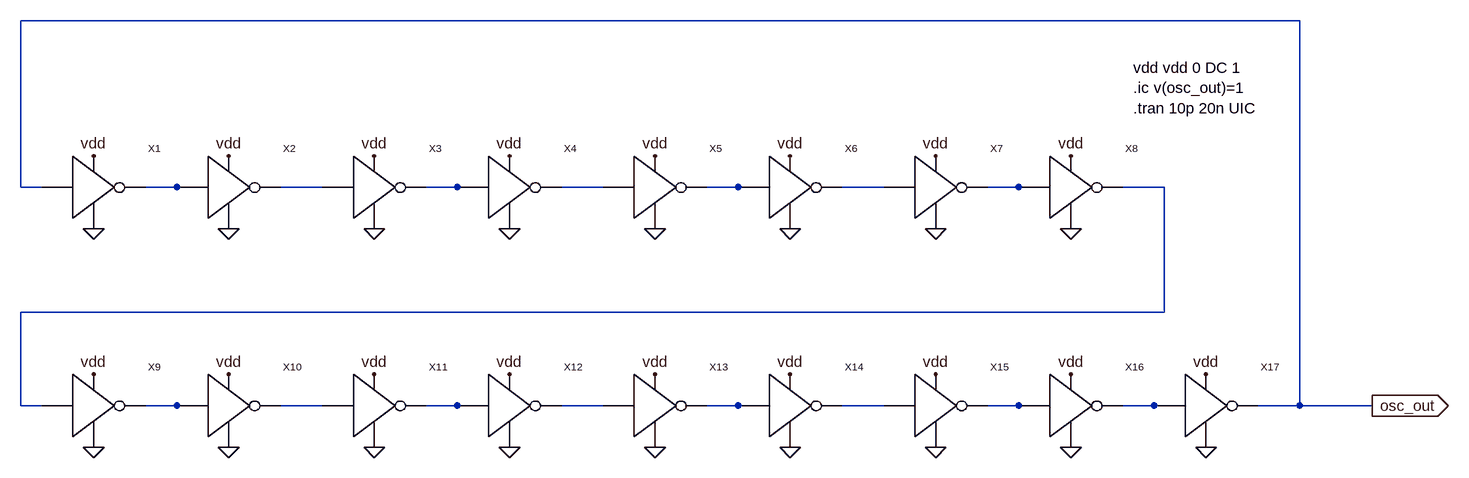
[diagram p0: schematic ringoscillator.asc]
ringoscillator.asc, the LTspice schematic file:
Version 4
SHEET 1 2264 680
WIRE 2000 -80 32 -80
WIRE 32 176 32 -80
WIRE 64 176 32 176
WIRE 272 176 224 176
WIRE 288 176 272 176
WIRE 496 176 432 176
WIRE 704 176 656 176
WIRE 720 176 704 176
WIRE 928 176 864 176
WIRE 1136 176 1088 176
WIRE 1152 176 1136 176
WIRE 1360 176 1296 176
WIRE 1568 176 1520 176
WIRE 1584 176 1568 176
WIRE 1792 176 1728 176
WIRE 1792 368 1792 176
WIRE 1792 368 32 368
WIRE 32 512 32 368
WIRE 64 512 32 512
WIRE 272 512 224 512
WIRE 288 512 272 512
WIRE 496 512 432 512
WIRE 704 512 656 512
WIRE 720 512 704 512
WIRE 928 512 864 512
WIRE 1136 512 1088 512
WIRE 1152 512 1136 512
WIRE 1360 512 1296 512
WIRE 1568 512 1520 512
WIRE 1584 512 1568 512
WIRE 1776 512 1728 512
WIRE 1792 512 1776 512
WIRE 2000 512 2000 -80
WIRE 2000 512 1936 512
WIRE 2112 512 2000 512
FLAG 144 240 0
FLAG 144 128 vdd
FLAG 352 240 0
FLAG 352 128 vdd
FLAG 576 240 0
FLAG 576 128 vdd
FLAG 784 240 0
FLAG 784 128 vdd
FLAG 1008 240 0
FLAG 1008 128 vdd
FLAG 1216 240 0
FLAG 1216 128 vdd
FLAG 1440 240 0
FLAG 1440 128 vdd
FLAG 1648 240 0
FLAG 1648 128 vdd
FLAG 144 576 0
FLAG 144 464 vdd
FLAG 352 576 0
FLAG 352 464 vdd
FLAG 576 576 0
FLAG 576 464 vdd
FLAG 784 576 0
FLAG 784 464 vdd
FLAG 1008 576 0
FLAG 1008 464 vdd
FLAG 1216 576 0
FLAG 1216 464 vdd
FLAG 1440 576 0
FLAG 1440 464 vdd
FLAG 1648 576 0
FLAG 1648 464 vdd
FLAG 1856 576 0
FLAG 1856 464 vdd
FLAG 2112 512 osc_out
IOPIN 2112 512 Out
SYMBOL Inverter 112 176 R0
SYMATTR InstName X1
SYMBOL Inverter 320 176 R0
SYMATTR InstName X2
SYMBOL Inverter 544 176 R0
SYMATTR InstName X3
SYMBOL Inverter 752 176 R0
SYMATTR InstName X4
SYMBOL Inverter 976 176 R0
SYMATTR InstName X5
SYMBOL Inverter 1184 176 R0
SYMATTR InstName X6
SYMBOL Inverter 1408 176 R0
SYMATTR InstName X7
SYMBOL Inverter 1616 176 R0
SYMATTR InstName X8
SYMBOL Inverter 112 512 R0
SYMATTR InstName X9
SYMBOL Inverter 320 512 R0
SYMATTR InstName X10
SYMBOL Inverter 544 512 R0
SYMATTR InstName X11
SYMBOL Inverter 752 512 R0
SYMATTR InstName X12
SYMBOL Inverter 976 512 R0
SYMATTR InstName X13
SYMBOL Inverter 1184 512 R0
SYMATTR InstName X14
SYMBOL Inverter 1408 512 R0
SYMATTR InstName X15
SYMBOL Inverter 1616 512 R0
SYMATTR InstName X16
SYMBOL Inverter 1824 512 R0
SYMATTR InstName X17
TEXT 1744 -8 Left 2 !vdd vdd 0 DC 1\n.ic v(osc_out)=1\n.tran 10p 20n UIC

The netlist it stands for:
* ringoscillator.asc
XX1 osc_out N001 vdd 0 Inverter  ; pins in out vdd DGND
XX2 N001 N002 vdd 0 Inverter  ; pins in out vdd DGND
XX3 N002 N003 vdd 0 Inverter  ; pins in out vdd DGND
XX4 N003 N004 vdd 0 Inverter  ; pins in out vdd DGND
XX5 N004 N005 vdd 0 Inverter  ; pins in out vdd DGND
XX6 N005 N006 vdd 0 Inverter  ; pins in out vdd DGND
XX7 N006 N007 vdd 0 Inverter  ; pins in out vdd DGND
XX8 N007 N008 vdd 0 Inverter  ; pins in out vdd DGND
XX9 N008 N009 vdd 0 Inverter  ; pins in out vdd DGND
XX10 N009 N010 vdd 0 Inverter  ; pins in out vdd DGND
XX11 N010 N011 vdd 0 Inverter  ; pins in out vdd DGND
XX12 N011 N012 vdd 0 Inverter  ; pins in out vdd DGND
XX13 N012 N013 vdd 0 Inverter  ; pins in out vdd DGND
XX14 N013 N014 vdd 0 Inverter  ; pins in out vdd DGND
XX15 N014 N015 vdd 0 Inverter  ; pins in out vdd DGND
XX16 N015 N016 vdd 0 Inverter  ; pins in out vdd DGND
XX17 N016 osc_out vdd 0 Inverter  ; pins in out vdd DGND
vdd vdd 0 DC 1
.ic v(osc_out)=1
.tran 10p 20n UIC
.backanno
.end